# Altium schematic sheet Sheet1.SchDoc
size 420 x 297 mm; SheetNumber: 1; SheetTotal: 3
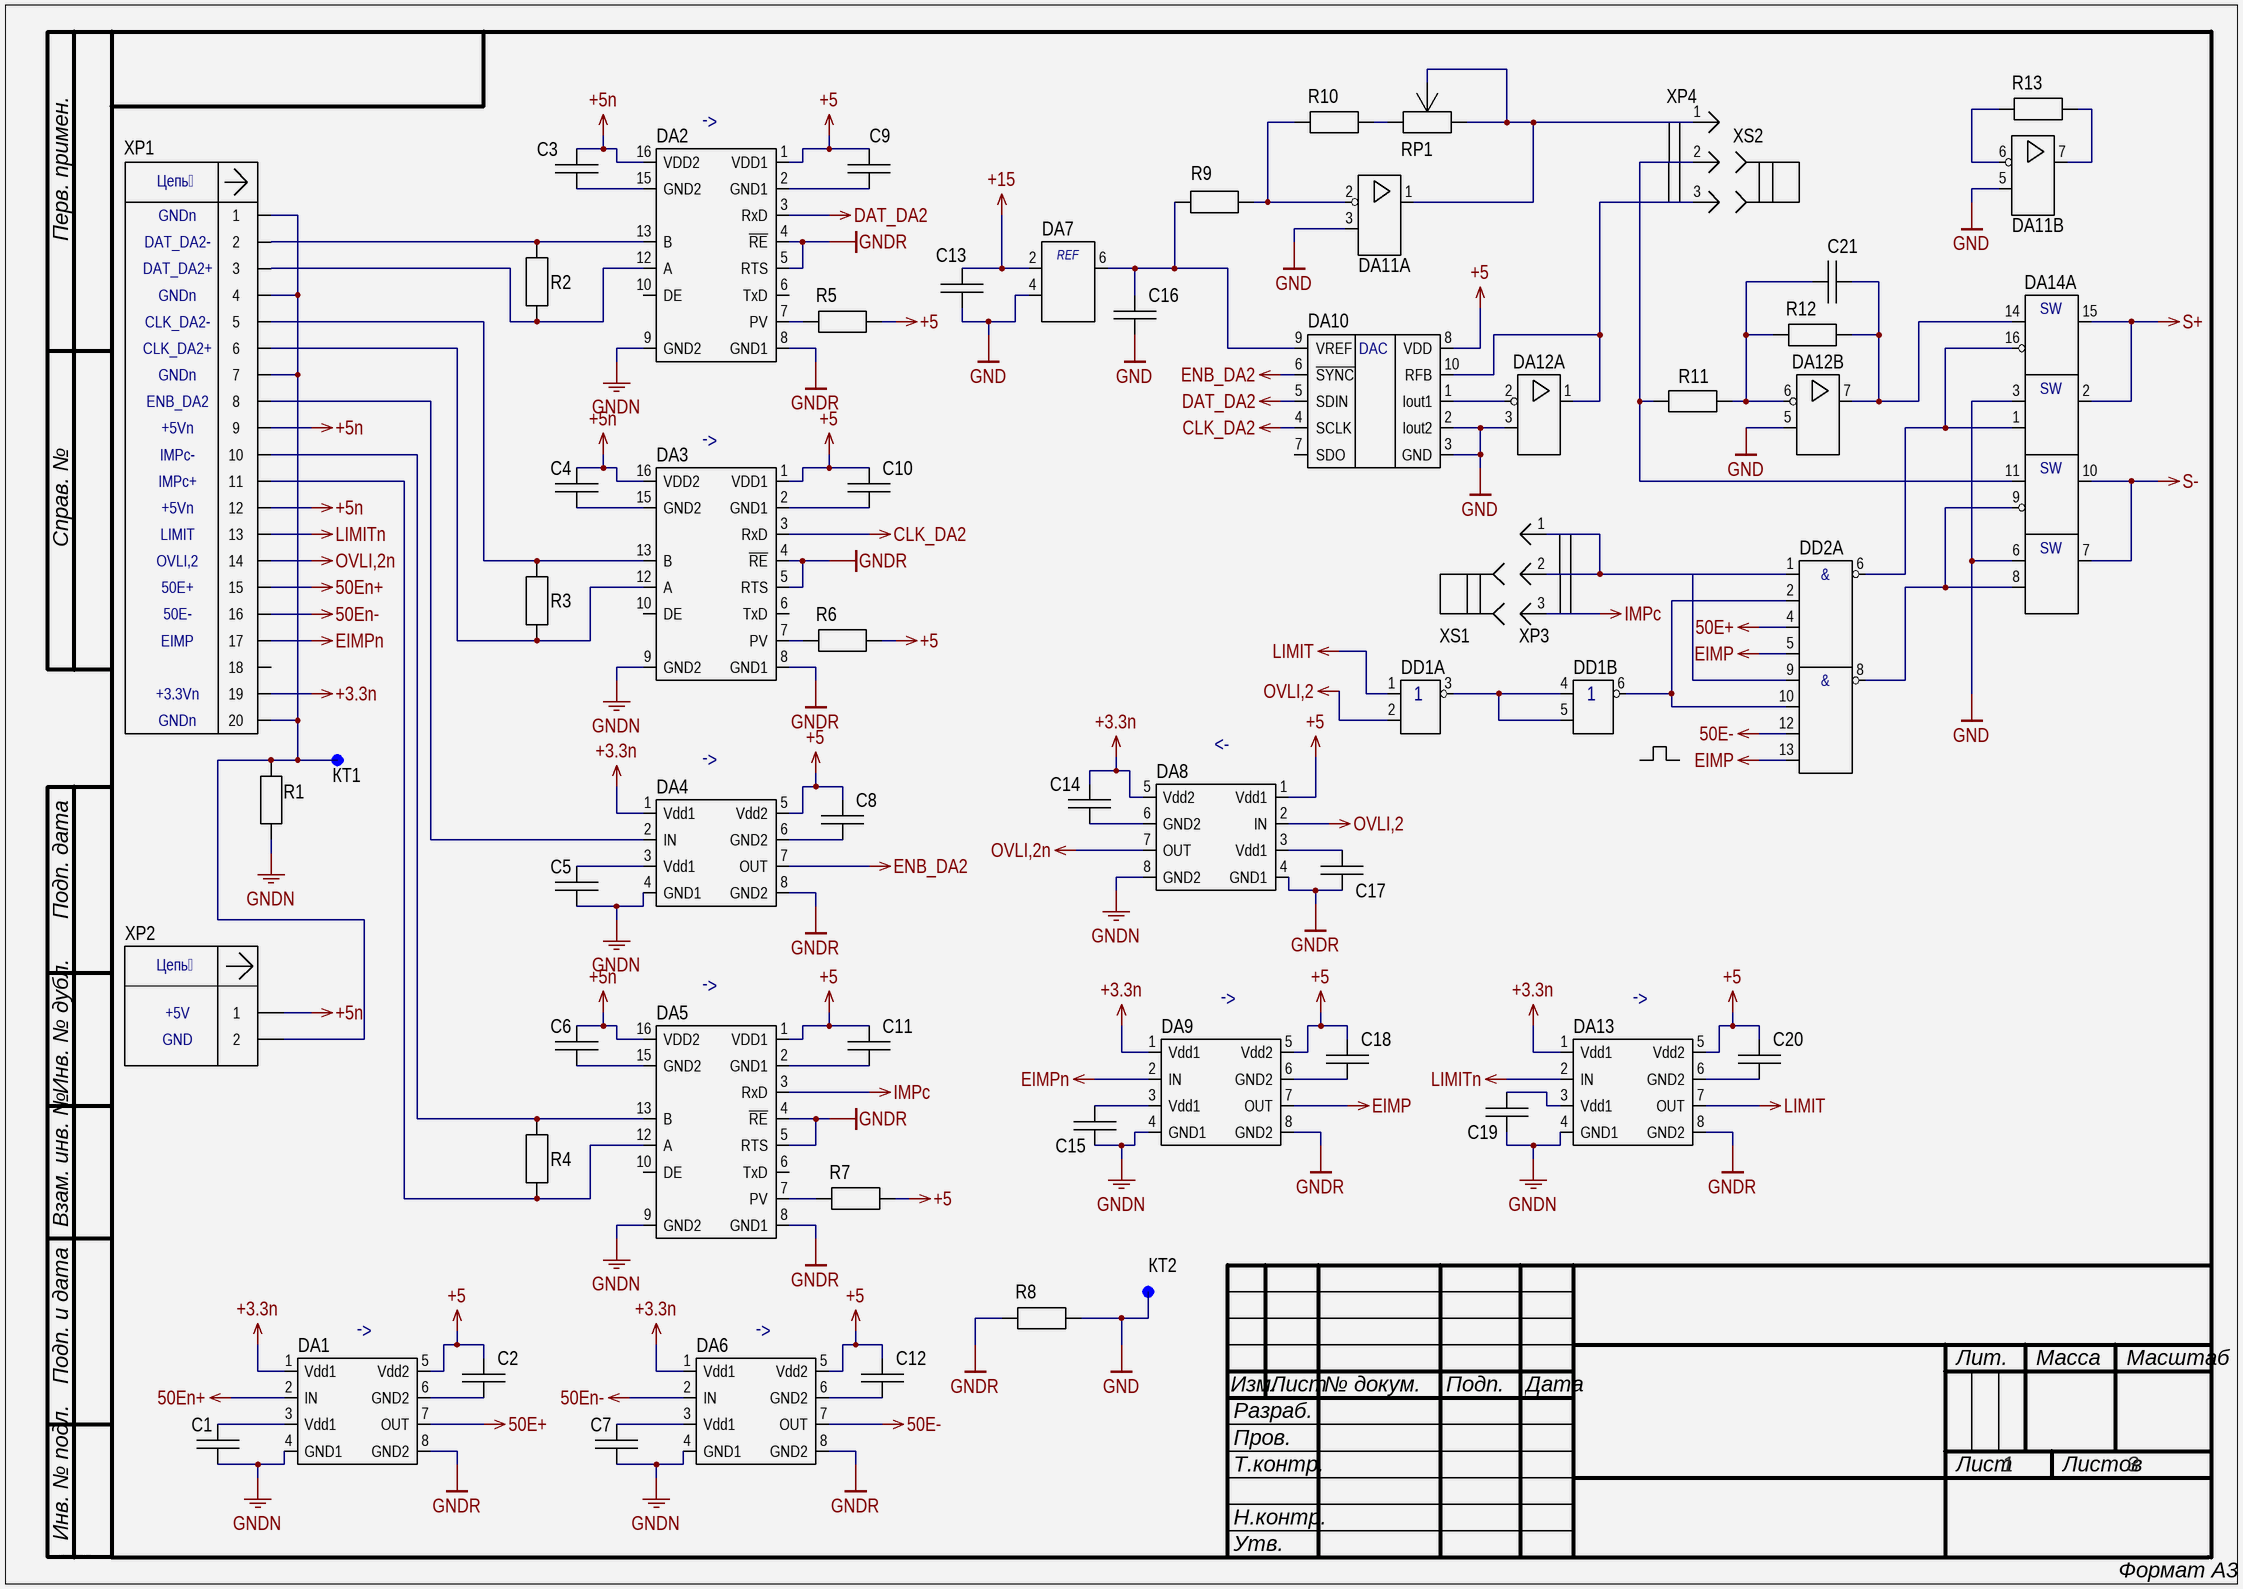
[diagram p0: Sheet1.SchDoc]

## Parts
C1  0805-X7R-25 В-0,1 мкФ +-10%  [CAP: 0805]  (value not drawn)
C2  0805-X7R-25 В-0,1 мкФ +-10%  [CAP: 0805]  (value not drawn)
C3  0805-X7R-25 В-0,1 мкФ +-10%  [CAP: 0805]  (value not drawn)
C4  0805-X7R-25 В-0,1 мкФ +-10%  [CAP: 0805]  (value not drawn)
C5  0805-X7R-25 В-0,1 мкФ +-10%  [CAP: 0805]  (value not drawn)
C6  0805-X7R-25 В-0,1 мкФ +-10%  [CAP: 0805]  (value not drawn)
C7  0805-X7R-25 В-0,1 мкФ +-10%  [CAP: 0805]  (value not drawn)
C8  0805-X7R-25 В-0,1 мкФ +-10%  [CAP: 0805]  (value not drawn)
C9  0805-X7R-25 В-0,1 мкФ +-10%  [CAP: 0805]  (value not drawn)
C10  0805-X7R-25 В-0,1 мкФ +-10%  [CAP: 0805]  (value not drawn)
C11  0805-X7R-25 В-0,1 мкФ +-10%  [CAP: 0805]  (value not drawn)
C12  0805-X7R-25 В-0,1 мкФ +-10%  [CAP: 0805]  (value not drawn)
C13  0805-X7R-25 В-0,1 мкФ +-10%  [CAP: 0805]  (value not drawn)
C14  0805-X7R-25 В-0,1 мкФ +-10%  [CAP: 0805]  (value not drawn)
C15  0805-X7R-25 В-0,1 мкФ +-10%  [CAP: 0805]  (value not drawn)
C16  0805-X7R-25 В-0,1 мкФ +-10%  [CAP: 0805]  (value not drawn)
C17  0805-X7R-25 В-0,1 мкФ +-10%  [CAP: 0805]  (value not drawn)
C18  0805-X7R-25 В-0,1 мкФ +-10%  [CAP: 0805]  (value not drawn)
C19  0805-X7R-25 В-0,1 мкФ +-10%  [CAP: 0805]  (value not drawn)
C20  0805-X7R-25 В-0,1 мкФ +-10%  [CAP: 0805]  (value not drawn)
C21  1206-C0G-50 В-22 пФ +-5%  [CAP: 1206]  (value not drawn)
DA1  ADuM1100AR  [8-SOIC]  (value not drawn)
DA2  ADM2486BRWZ  [16-SOIC W]  (value not drawn)
DA3  ADM2486BRWZ  [16-SOIC W]  (value not drawn)
DA4  ADuM1100AR  [8-SOIC]  (value not drawn)
DA5  ADM2486BRWZ  [16-SOIC W]  (value not drawn)
DA6  ADuM1100AR  [8-SOIC]  (value not drawn)
DA7  ADR435BRZ  [8-SOIC]  (value not drawn)
DA8  ADuM1100AR  [8-SOIC]  (value not drawn)
DA9  ADuM1100AR  [8-SOIC]  (value not drawn)
DA10  AD5443YRM  [10-MSOP]  (value not drawn)
DA11  ADA4084-2ARZ  [8-SOIC]  (value not drawn)  (parts A,B of 3)
DA12  ADA4084-2ARZ  [8-SOIC]  (value not drawn)  (parts A,B of 3)
DA13  ADuM1100AR  [8-SOIC]  (value not drawn)
DA14  ADG433BR  [16-SOIC]  (value not drawn)  (part A of 2)
DD1  IN74HC00AD  [14-soic]  (value not drawn)  (parts A,B of 5)
DD2  IN74HC20D  [14-SOIC]  (value not drawn)  (part A of 2)
R1  1206-10 Ом+-5%  [1206]  (value not drawn)
R2  1206-100 Ом+-5%  [1206]  (value not drawn)
R3  1206-100 Ом+-5%  [1206]  (value not drawn)
R4  1206-100 Ом+-5%  [1206]  (value not drawn)
R5  1206-12 кОм+-5%  [1206]  (value not drawn)
R6  1206-12 кОм+-5%  [1206]  (value not drawn)
R7  1206-12 кОм+-5%  [1206]  (value not drawn)
R8  1206-10 Ом+-5%  [1206]  (value not drawn)
R9  1206-10 кОм+-0,5%  [1206]  (value not drawn)
R10  1206-100 Ом+-0,5%  [1206]  (value not drawn)
R11  1206-10 кОм+-0,5%  [1206]  (value not drawn)
R12  1206-10 кОм+-0,5%  [1206]  (value not drawn)
R13  1206-12 кОм+-1%  [1206]  (value not drawn)
RP1  3362P-1-103LF  [BOUR-3362P]  (value not drawn)
XP1  BH2-20  [DS1014-20]  (value not drawn)
XP2  280370-2  [280370-2]  (value not drawn)
XP3  DS1021-1x3  [3X2.54]  (value not drawn)
XP4  DS1021-1x3  [3X2.54]  (value not drawn)
XS1  Jumper, 2.54mm  (value not drawn)
XS2  Jumper, 2.54mm  (value not drawn)
КТ1  Lepestok  [LEPESTOK7750224]  (value not drawn)
КТ2  Lepestok  [LEPESTOK7750224]  (value not drawn)

## Nets
50E+: DA1.7(OUT) DD2.4(C1)
50E-: DA6.7(OUT) DD2.12(C2)
50En+: DA1.2(IN) XP1.15
50En-: DA6.2(IN) XP1.16
+3.3n: C14.1 DA1.1(Vdd1) DA4.1(Vdd1) DA6.1(Vdd1) DA8.5(Vdd2) DA9.1(Vdd1) DA13.1(Vdd1) XP1.19
+5: C2.1 C8.1 C9.2 C10.2 C11.2 C12.1 C18.1 C20.1 DA1.5(Vdd2) DA2.1(VDD1) DA3.1(VDD1) DA4.5(Vdd2) DA5.1(VDD1) DA6.5(Vdd2) DA8.1(Vdd1) DA9.5(Vdd2) DA10.8(VDD) DA13.5(Vdd2) R5.1 R6.1 R7.1
+5n: C3.2 C4.2 C6.2 DA2.16(VDD2) DA3.16(VDD2) DA5.16(VDD2) XP1.9 XP1.12 XP2.1
+15: C13.1 DA7.2(VIN)
CLK_DA2: DA3.3(RxD) DA10.4(SCLK)
DAT_DA2: DA2.3(RxD) DA10.5(SDIN)
EIMP: DA9.7(OUT) DD2.5(D1) DD2.13(D2)
EIMPn: DA9.2(IN) XP1.17
ENB_DA2: DA4.7(OUT) DA10.6(~{SYNC})
GND: C13.2 C16.1 DA7.4(GND) DA10.2(Iout2) DA10.3(GND) DA11.3(+IN_A) DA11.5(+IN_B) DA12.3(+IN_A) DA12.5(+IN_B) DA14.3(S1) DA14.6(S4) R8.2 КТ2.1
GNDN: C1.1 C5.1 C7.1 C15.1 C19.1 DA1.4(GND1) DA2.9(GND2) DA3.9(GND2) DA4.4(GND1) DA5.9(GND2) DA6.4(GND1) DA8.8(GND2) DA9.4(GND1) DA13.4(GND1) R1.1
GNDR: C17.1 DA1.8(GND2) DA2.4(~{RE}) DA2.5(RTS) DA2.8(GND1) DA3.4(~{RE}) DA3.5(RTS) DA3.8(GND1) DA4.8(GND2) DA5.4(~{RE}) DA5.5(RTS) DA5.8(GND1) DA6.8(GND2) DA8.4(GND1) DA9.8(GND2) DA13.8(GND2) R8.1
IMPc: DA5.3(RxD) XP3.3
LIMIT: DA13.7(OUT) DD1.1(A1)
LIMITn: DA13.2(IN) XP1.13
OVLI,2: DA8.2(IN) DD1.2(B1)
OVLI,2n: DA8.7(OUT) XP1.14
S+: DA14.2(D1) DA14.15(D2)
S-: DA14.7(D4) DA14.10(D3)
NetC1_2: C1.2 DA1.3(Vdd1)
NetC2_2: C2.2 DA1.6(GND2)
NetC3_1: C3.1 DA2.15(GND2)
NetC4_1: C4.1 DA3.15(GND2)
NetC5_2: C5.2 DA4.3(Vdd1)
NetC6_1: C6.1 DA5.15(GND2)
NetC7_2: C7.2 DA6.3(Vdd1)
NetC8_2: C8.2 DA4.6(GND2)
NetC9_1: C9.1 DA2.2(GND1)
NetC10_1: C10.1 DA3.2(GND1)
NetC11_1: C11.1 DA5.2(GND1)
NetC12_2: C12.2 DA6.6(GND2)
NetC14_2: C14.2 DA8.6(GND2)
NetC15_2: C15.2 DA9.3(Vdd1)
NetC16_2: C16.2 DA7.6(VOUT) DA10.9(VREF) R9.1
NetC17_2: C17.2 DA8.3(Vdd1)
NetC18_2: C18.2 DA9.6(GND2)
NetC19_2: C19.2 DA13.3(Vdd1)
NetC20_2: C20.2 DA13.6(GND2)
NetC21_1: C21.1 DA12.6(-IN_B) R11.2 R12.1
NetC21_2: C21.2 DA12.7(OUT_B) DA14.14(S2) R12.2
NetDA2_7: DA2.7(PV) R5.2
NetDA2_12: DA2.12(A) R2.1 XP1.3
NetDA2_13: DA2.13(B) R2.2 XP1.2
NetDA3_7: DA3.7(PV) R6.2
NetDA3_12: DA3.12(A) R3.1 XP1.6
NetDA3_13: DA3.13(B) R3.2 XP1.5
NetDA4_2: DA4.2(IN) XP1.8
NetDA5_7: DA5.7(PV) R7.2
NetDA5_12: DA5.12(A) R4.1 XP1.11
NetDA5_13: DA5.13(B) R4.2 XP1.10
NetDA10_1: DA10.1(Iout1) DA12.2(-IN_A)
NetDA10_10: DA10.10(RFB) DA12.1(OUT_A) XP4.3
NetDA11_1: DA11.1(OUT_A) RP1.1 RP1.2(WIPER) XP4.1
NetDA11_2: DA11.2(-IN_A) R9.2 R10.1
NetDA11_6: DA11.6(-IN_B) R13.1
NetDA11_7: DA11.7(OUT_B) R13.2
NetDA14_1: DA14.1(IN1) DA14.16(IN2) DD2.6(Y1)
NetDA14_8: DA14.8(IN4) DA14.9(IN3) DD2.8(Y2)
NetDA14_11: DA14.11(S3) R11.1 XP4.2
NetDD1_3: DD1.3(Y1) DD1.4(A2) DD1.5(B2)
NetDD1_6: DD1.6(Y2) DD2.2(B1) DD2.10(B2)
NetDD2_1: DD2.1(A1) DD2.9(A2) XP3.1 XP3.2
NetR1_2: R1.2 XP1.1 XP1.4 XP1.7 XP1.20 XP2.2 КТ1.1
NetR10_2: R10.2 RP1.3

Not connected (* = marked no-connect by the designer): DA2 6(TxD) 10(DE); DA3 6(TxD) 10(DE); DA5 6(TxD) 10(DE); DA10 7(SDO); XP1 18

## Notes on the sheet
- (near DA2) <-
- (near XP1) DAT_DA2-
- GNDn
- (near XP1) 1
- (near XP1) 2
- (near XP1) DAT_DA2+
- (near XP1) CLK_DA2-
- (near XP1) 3
- (near XP1) 4
- (near XP1) 5
- (near XP1) CLK_DA2+
- (near XP1) ENB_DA2
- (near XP1) 6
- (near XP1) 7
- (near XP1) 8
- IMPc-
- +5Vn
- (near XP1) 9
- (near XP1) 10
- (near DA3) <-
- IMPc+
- LIMIT
- (near XP1) 11
- (near XP1) 12
- (near XP1) 13
- OVLI,2
- 50E+
- (near XP1) 14
- (near XP1) 15
- EIMP
- 50E-
- (near XP1) 16
- (near XP1) 17
- (near XP1) 18
- +3.3Vn
- (near XP1) 19
- (near XP1) 20
- (near DA4) <-
- (near DA8) <-
- (near DA5) <-
- (near DA9) <-
- (near DA13) <-
- +5V
- GND
- (near DA1) <-
- (near DA6) <-
- Перв. примен.
- Справ. №
- Подп. дата
- Инв. № дубл.
- Взам. инв. №
- Подп. и дата
- Изм.
- Разраб.
- Лист
- № докум.
- Подп.
- Дата
- Лит.
- Масса
- Масштаб
- Пров.
- Т.контр.
- Листов
- Инв. № подл.
- Н.контр.
- Утв.
- ALTIUM GOSTBOM2.0 KEV
- Формат А3
- (in symbol 280370-2) Цепь
- (in symbol AD5443YRM) DAC
- (in symbol ADG433BR_1, part A) SW
- (in symbol ADR435BRZ) REF
- (in symbol BH2-20) Цепь
- (in symbol IN74HC20D_1, part A) &

## Library data of the parts
C1-C20 = 0805-X7R-25 В-0,1 мкФ +-10%: Value: 0,1 мкФ
C21 = 1206-C0G-50 В-22 пФ +-5%: Value: 22 пФ
DA2 DA3 DA5 = ADM2486BRWZ: Isolated RS-485 Transceiver,  20 Mbps data rate, SOIC-16-W
DA10 = AD5443YRM: 12-Bit High Bandwidth / Multiplying DACs with Serial Interface / 10-MSOP
DA11 DA12 = ADA4084-2ARZ: 30 V, Low Noise, Rail-to-Rail Input/Output, / Low Power Operational Amplifiers
DA14 = ADG433BR_1: LC2MOS Precision Quad SPST Switches; Value: *
DD1 = IN74HC00AD: Quad 2-Input NAND Gate High-Performance Silicon-Gate CMOS.
DD2 = IN74HC20D_1: Dual 4-input  NAND Gate CMOS
R1 R8 = 1206-10 Ом+-5%: Value: 10 Ом; ModelPrint: 1206
R2-R4 = 1206-100 Ом+-5%: Value: 100 Ом; ModelPrint: 1206
R5-R7 = 1206-12 кОм+-5%: Value: 12 кОм; ModelPrint: 1206
R9 R11 R12 = 1206-10 кОм+-0,5%: Value: 10 кОм; ModelPrint: 1206
R10 = 1206-100 Ом+-0,5%: Value: 100 Ом; ModelPrint: 1206
R13 = 1206-12 кОм+-1%: Value: 12 кОм; ModelPrint: 1206
RP1 = 3362P-1-103LF: 3362 -1/4 ˝ Square Trimpot® Trimming Potentiometer
XP1 = BH2-20: IDC2-20MS DS1014 20 pin
XP2 = 280370-2: Connector
XP3 XP4 = DS1021-1x3_1: PLS-3, 2.54 pitch; 1: *; 2: *; 3: *